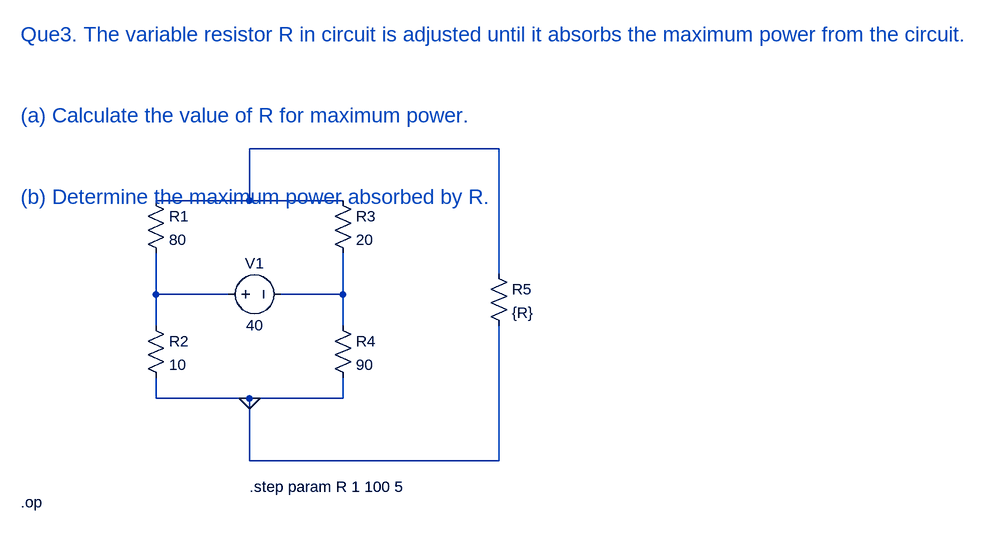
[diagram p0: schematic 3_Dheerendra_23EE019_Power_Transfer.asc]
3_Dheerendra_23EE019_Power_Transfer.asc, the LTspice schematic file:
Version 4
SHEET 1 1332 680
WIRE 464 -48 80 -48
WIRE 80 32 80 -48
WIRE 80 32 -64 32
WIRE 224 32 80 32
WIRE 464 144 464 -48
WIRE -64 176 -64 112
WIRE 48 176 -64 176
WIRE 224 176 224 112
WIRE 224 176 128 176
WIRE -64 224 -64 176
WIRE 224 224 224 176
WIRE -64 336 -64 304
WIRE 80 336 -64 336
WIRE 224 336 224 304
WIRE 224 336 80 336
WIRE 80 432 80 336
WIRE 464 432 464 224
WIRE 464 432 80 432
FLAG 80 336 0
SYMBOL res -80 16 R0
SYMATTR InstName R1
SYMATTR Value 80
SYMBOL res -80 208 R0
SYMATTR InstName R2
SYMATTR Value 10
SYMBOL res 208 16 R0
SYMATTR InstName R3
SYMATTR Value 20
SYMBOL res 208 208 R0
SYMATTR InstName R4
SYMATTR Value 90
SYMBOL voltage 32 176 R270
WINDOW 0 32 56 VTop 2
WINDOW 3 -32 56 VBottom 2
WINDOW 123 0 0 Left 0
WINDOW 39 0 0 Left 0
SYMATTR InstName V1
SYMATTR Value 40
SYMBOL res 448 128 R0
SYMATTR InstName R5
SYMATTR Value {R}
TEXT -272 -224 Left 3 ;Que3. The variable resistor R in circuit is adjusted until it absorbs the maximum power from the circuit.\n \n\n(a) Calculate the value of R for maximum power.\n \n\n(b) Determine the maximum power absorbed by R.
TEXT 80 472 Left 2 !.step param R 1 100 5
TEXT -272 496 Left 2 !.op

The netlist it stands for:
* 3_Dheerendra_23EE019_Power_Transfer.asc
R1 N001 N002 80
R2 N002 0 10
R3 N001 N003 20
R4 N003 0 90
V1 N002 N003 40
R5 N001 0 {R}
* Que3. The variable resistor R in circuit is adjusted until it absorbs the maximum power from the circuit.
* (a) Calculate the value of R for maximum power.
* (b) Determine the maximum power absorbed by R.
.step param R 1 100 5
.op
.backanno
.end